# EAGLE schematic powerSupply (EAGLE 9.5.2)
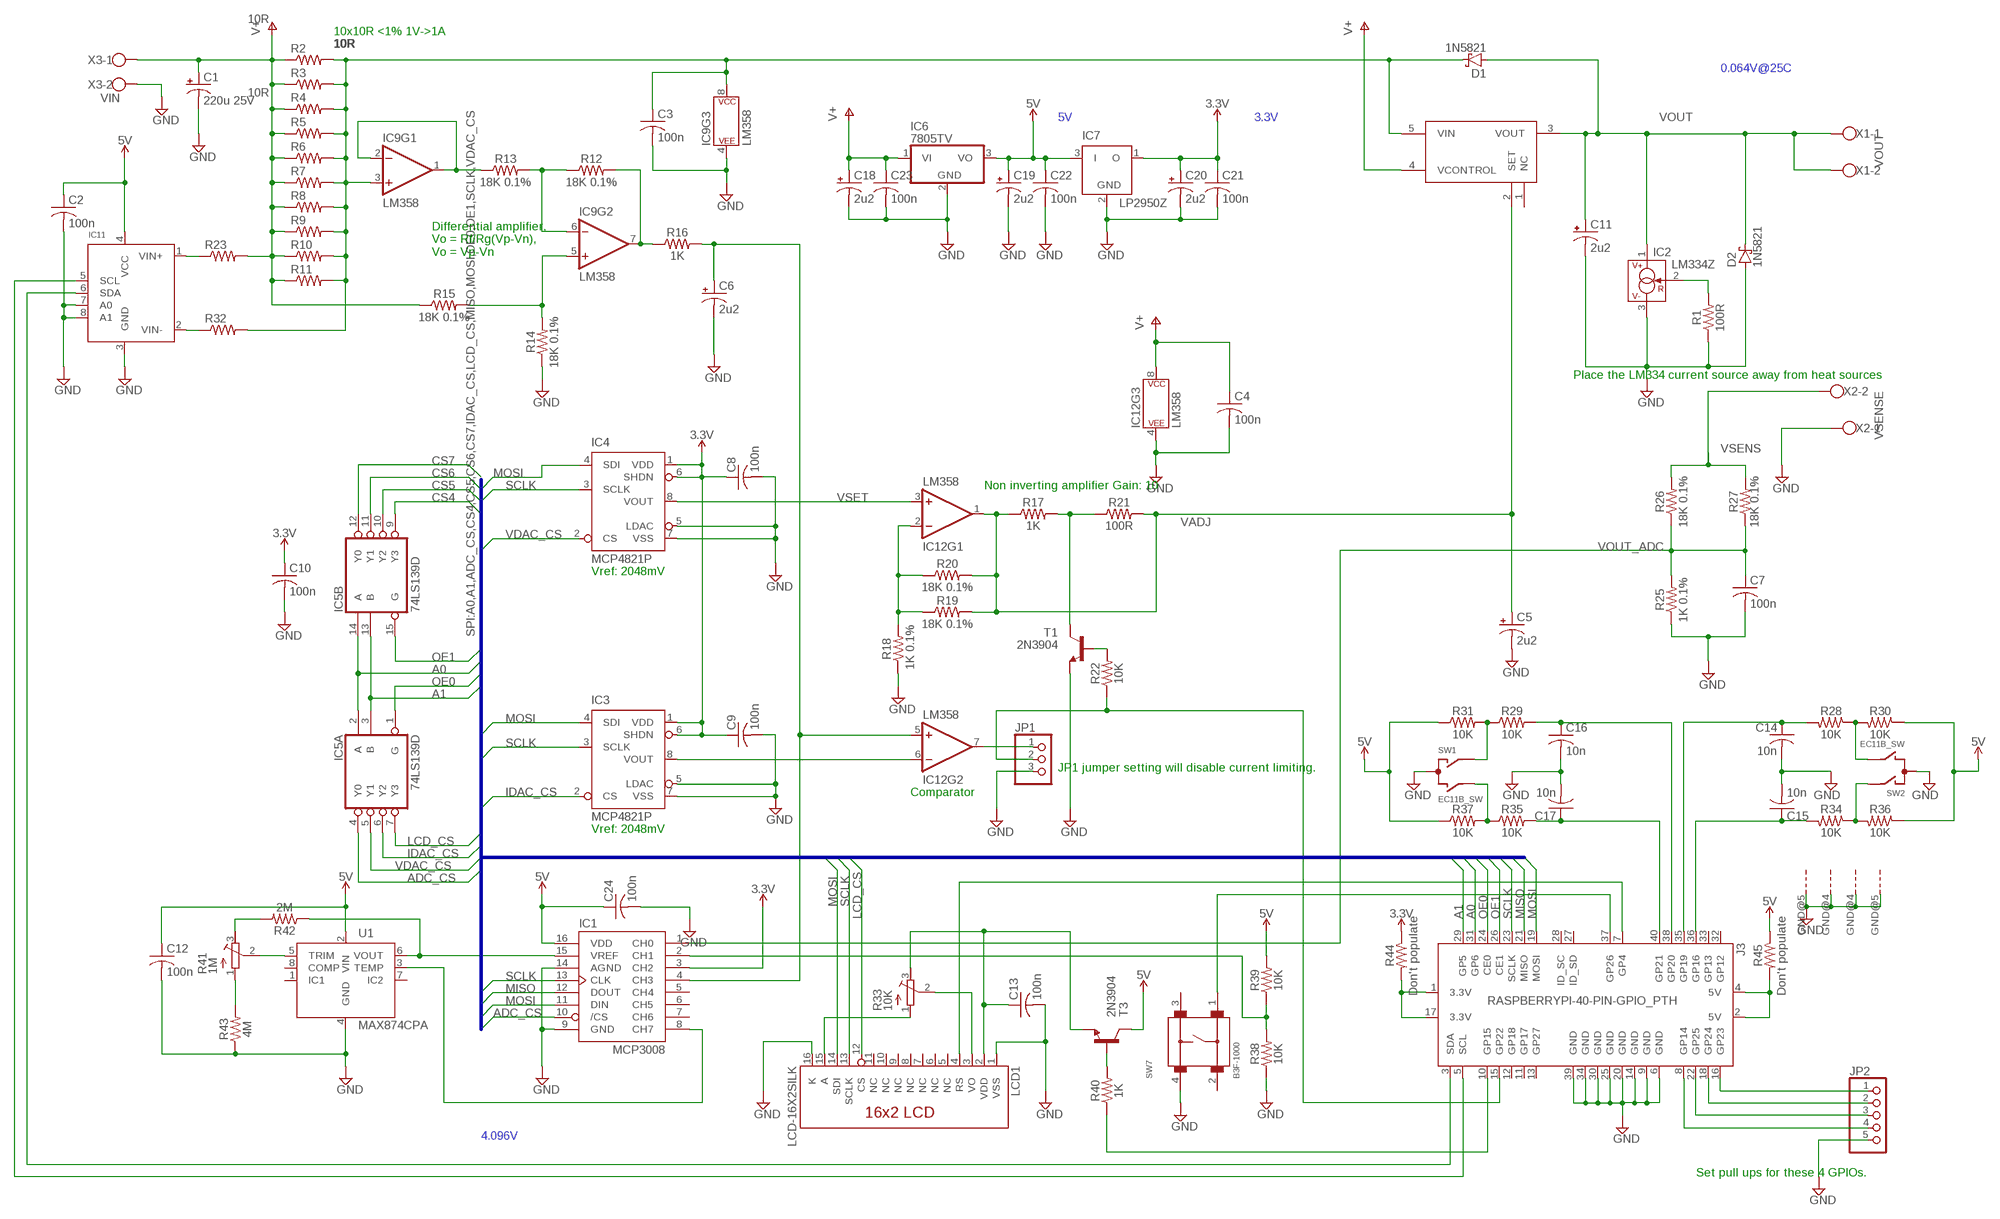
[diagram p0: schematic, sheet 1]

## Parts
C1  220u 25V  CPOL-USE5-6  [E5-6]
C2  100n  C-US050-024X044  [C050-024X044]
C3  100n  C-US050-024X044  [C050-024X044]
C4  100n  C-US050-024X044  [C050-024X044]
C5  2u2  CPOL-USE2-5  [E2-5]
C6  2u2  CPOL-USE2-5  [E2-5]
C7  100n  C-US050-024X044  [C050-024X044]
C8  100n  C-US050-024X044  [C050-024X044]
C9  100n  C-US050-024X044  [C050-024X044]
C10  100n  C-US050-024X044  [C050-024X044]
C11  2u2  CPOL-USE2-5  [E2-5]
C12  100n  C-US050-024X044  [C050-024X044]
C13  100n  C-US050-024X044  [C050-024X044]
C14  10n  C-US050-024X044  [C050-024X044]
C15  10n  C-US050-024X044  [C050-024X044]
C16  10n  C-US050-024X044  [C050-024X044]
C17  10n  C-US050-024X044  [C050-024X044]
C18  2u2  CPOL-USE2-5  [E2-5]
C19  2u2  CPOL-USE2-5  [E2-5]
C20  2u2  CPOL-USE2-5  [E2-5]
C21  100n  C-US050-024X044  [C050-024X044]
C22  100n  C-US050-024X044  [C050-024X044]
C23  100n  C-US050-024X044  [C050-024X044]
C24  100n  C-US050-024X044  [C050-024X044]
D1  1N5821  SCHOTTKY-DIODEC4111-15  [C4111-15]
D2  1N5821  SCHOTTKY-DIODEC4111-15  [C4111-15]
IC1  MCP3008  [DIL16]
IC2  LM334Z  [TO92]
IC3  MCP4821P  [DIP08]
IC4  MCP4821P  [DIP08]
IC5  74LS139D  [SO16]
IC6  7805TV  [TO220V]
IC7  LP2950Z  [TO92]
IC8  LT3080T  [TO220-5]
IC9  LM358  [DIP08]
IC11  INA219  [SOT23-8]
IC12  LM358  [DIP08]
J3  RASPBERRYPI-40-PIN-GPIO_PTH  [2X20_SHROUDED]
JP1  PINHD-1X3  [1X03]
JP2  PINHD-1X5  [1X05]
LCD1  LCD-16X2SILK  [LCD-16X2]
R1  100R  R-US_0204/7  [0204/7]
R2  10R  R-US_0207/12  [0207/12]
R3  10R  R-US_0207/12  [0207/12]
R4  10R  R-US_0207/12  [0207/12]
R5  10R  R-US_0207/12  [0207/12]
R6  10R  R-US_0207/12  [0207/12]
R7  10R  R-US_0207/12  [0207/12]
R8  10R  R-US_0207/12  [0207/12]
R9  10R  R-US_0207/12  [0207/12]
R10  10R  R-US_0207/12  [0207/12]
R11  10R  R-US_0207/12  [0207/12]
R12  18K 0.1%  R-US_0204/7  [0204/7]
R13  18K 0.1%  R-US_0204/7  [0204/7]
R14  18K 0.1%  R-US_0204/7  [0204/7]
R15  18K 0.1%  R-US_0204/7  [0204/7]
R16  1K  R-US_0204/7  [0204/7]
R17  1K  R-US_0204/7  [0204/7]
R18  1K 0.1%  R-US_0204/7  [0204/7]
R19  18K 0.1%  R-US_0204/7  [0204/7]
R20  18K 0.1%  R-US_0204/7  [0204/7]
R21  100R  R-US_0204/7  [0204/7]
R22  10K  R-US_0204/7  [0204/7]
R23  10R  R-US_0207/12  [0207/12]
R25  1K 0.1%  R-US_0204/7  [0204/7]
R26  18K 0.1%  R-US_0204/7  [0204/7]
R27  18K 0.1%  R-US_0204/7  [0204/7]
R28  10K  R-US_0204/7  [0204/7]
R29  10K  R-US_0204/7  [0204/7]
R30  10K  R-US_0204/7  [0204/7]
R31  10K  R-US_0204/7  [0204/7]
R32  10R  R-US_0207/12  [0207/12]
R33  10K  R-TRIMM64W  [RTRIM64W]
R34  10K  R-US_0204/7  [0204/7]
R35  10K  R-US_0204/7  [0204/7]
R36  10K  R-US_0204/7  [0204/7]
R37  10K  R-US_0204/7  [0204/7]
R38  10K  R-US_0204/7  [0204/7]
R39  10K  R-US_0204/7  [0204/7]
R40  1K  R-US_0204/7  [0204/7]
R41  1M  R-TRIMM64W  [RTRIM64W]
R42  2M  R-US_0204/7  [0204/7]
R43  4M  R-US_0204/7  [0204/7]
R44  Don't populate  R-US_0204/7  [0204/7]
R45  Don't populate  R-US_0204/7  [0204/7]
SW1  EC11B_SW  [APLS_EC11B_SW]
SW2  EC11B_SW  [APLS_EC11B_SW]
SW7  B3F-1000  [B3F-1000]
T1  2N3904  [TO92]
T3  2N3904  [TO92]
U1  MAX874CPA  [DIP08]
X1  VOUT  W237-102  [W237-102]
X2  VSENSE  W237-102  [W237-102]
X3  VIN  W237-102  [W237-102]

## Nets
0.064V@25C: IC2.2(R) R1.2
3.3V: C8.1 C9.1 C10.1 C20.+ C21.1 IC1.3(CH2) IC3.1(VDD) IC3.6(SHDN) IC4.1(VDD) IC4.6(SHDN) IC7.1(O) R44.1
4.096V: IC1.15(VREF) R42.1 U1.6(VOUT)
5V: C2.1 C12.1 C19.+ C22.1 C24.1 IC1.16(VDD) IC6.3(VO) IC7.3(I) IC11.4(VCC) R30.1 R31.1 R36.1 R37.1 R39.2 R45.1 T3.1(C) U1.2(VIN)
A0: IC5.2(A:A) IC5.14(B:A) J3.31(GP6)
A1: IC5.3(A:B) IC5.13(B:B) J3.29(GP5)
ADC_CS: IC1.10(/CS) IC5.4(A:Y0)
ADC_IOUT: C6.+ IC1.4(CH3) IC12.5(+IN) R16.2
CS4: IC5.9(B:Y3)
CS5: IC5.10(B:Y2)
CS6: IC5.11(B:Y1)
CS7: IC5.12(B:Y0)
GND: C1.- C2.2 C3.2 C4.2 C5.- C6.- C7.2 C8.2 C9.2 C10.2 C11.- C12.2 C13.2 C14.2 C15.2 C16.2 C17.2 C18.- C19.- C20.- C21.2 C22.2 C23.2 C24.2 D2.A IC1.9(GND) IC1.14(AGND) IC2.3(V-) IC3.5(LDAC) IC3.7(VSS) IC4.5(LDAC) IC4.7(VSS) IC6.2(GND) IC7.2(GND) IC9.4(P$V-) IC11.3(GND) IC11.7(A0) IC11.8(A1) IC12.4(P$V-) J3.6(GND) J3.9(GND) J3.14(GND) J3.20(GND) J3.25(GND) J3.30(GND) J3.34(GND) J3.39(GND) JP1.3 JP2.5 LCD1.1(VSS) LCD1.16(K) R1.1 R14.1 R18.1 R25.1 R38.1 R43.1 SW1.GND@4(G) SW1.GND@5(G) SW1.P$3(C) SW2.GND@4(G) SW2.GND@5(G) SW2.P$3(C) SW7.4 T1.3(E) U1.4(GND) X2.1 X3.2
IDAC_CS: IC3.2(CS) IC5.6(A:Y2)
LCD_CS: IC5.7(A:Y3) LCD1.12(CS)
MISO: IC1.12(DOUT) J3.21(MISO)
MOSI: IC1.11(DIN) IC3.4(SDI) IC4.4(SDI) J3.19(MOSI) LCD1.14(SDI)
N$1: IC3.8(VOUT) IC12.6(-IN)
N$2: IC1.2(CH1) R38.2 R39.1
N$3: LCD1.3(VO) R33.2(S)
N$4: IC11.1(VIN+) R23.1
N$5: IC1.8(CH7) U1.3(TEMP)
N$6: IC9.1(OUT) IC9.2(-IN) R13.1
N$7: IC9.6(-IN) R12.1 R13.2
N$8: R17.2 R21.1 T1.1(C)
N$9: IC9.5(+IN) R14.2 R15.2
N$10: C4.1 IC12.8(P$V+) ; supply symbol labelled V+
N$11: IC9.7(OUT) R12.2 R16.1
N$12: R22.2 T1.2(B)
N$13: IC12.2(-IN) R18.2 R19.1 R20.1
N$14: IC12.7(OUT) JP1.1
N$18: LCD1.15(A) R33.1(A)
N$19: IC11.2(VIN-) R32.1
N$20: J3.15(GP22) JP1.2 R22.1
N$21: J3.7(GP4) LCD1.4(RS)
N$22: R28.1 R30.2 SW2.P$2(B)
N$23: C14.1 J3.35(GP19) R28.2
N$24: C15.1 J3.36(GP16) R34.2
N$25: R34.1 R36.2 SW2.P$1(A)
N$26: C16.1 J3.38(GP20) R29.2
N$27: C17.1 J3.40(GP21) R35.2
N$28: R29.1 R31.2 SW1.P$1(A)
N$29: R35.1 R37.2 SW1.P$2(B)
N$30: J3.16(GP23) JP2.1
N$31: J3.18(GP24) JP2.2
N$32: J3.22(GP25) JP2.3
N$33: J3.8(GP14) JP2.4
N$34: IC11.6(SDA) J3.3(SDA)
N$35: IC11.5(SCL) J3.5(SCL)
N$36: J3.37(GP26) SW7.1
N$37: R40.2 T3.2(B)
N$38: C13.1 LCD1.2(VDD) R33.3(E) T3.3(E)
N$39: J3.10(GP15) R40.1
N$40: R41.2(S) U1.5(TRIM)
N$41: R41.3(E) R42.2
N$42: J3.1(3.3V) J3.17(3.3V) R44.2
N$43: R41.1(A) R43.2
N$44: J3.2(5V) J3.4(5V) R45.2
OE0: IC5.1(A:G) J3.24(CE0)
OE1: IC5.15(B:G) J3.26(CE1)
SCLK: IC1.13(CLK) IC3.3(SCLK) IC4.3(SCLK) J3.23(SCLK) LCD1.13(SCLK)
V+: C1.+ C18.+ C23.1 IC6.1(VI) IC8.4(VCONTROL) R2.1 R3.1 R4.1 R5.1 R6.1 R7.1 R8.1 R9.1 R10.1 R11.1 R15.1 R23.2 X3.1
VADJ: C5.+ IC8.2(SET) IC12.1(OUT) R17.1 R19.2 R20.2 R21.2
VDAC_CS: IC4.2(CS) IC5.5(A:Y1)
VOUT: C11.+ D1.A D2.C IC2.1(V+) IC8.3(VOUT) X1.1 X1.2
VOUT_ADC: C7.1 IC1.1(CH0) R25.2 R26.1 R27.1
VR: C3.1 D1.C IC8.5(VIN) IC9.3(+IN) IC9.8(P$V+) R2.2 R3.2 R4.2 R5.2 R6.2 R7.2 R8.2 R9.2 R10.2 R11.2 R32.2
VSENS: R26.2 R27.2 X2.2
VSET: IC4.8(VOUT) IC12.3(+IN)
Unconnected: IC1.5(CH4) IC1.6(CH5) IC1.7(CH6) IC8.1(NC) J3.11(GP17) J3.12(GP18) J3.13(GP27) J3.27(ID_SD) J3.28(ID_SC) J3.32(GP12) J3.33(GP13) LCD1.5(NC) LCD1.6(NC) LCD1.7(NC) LCD1.8(NC) LCD1.9(NC) LCD1.10(NC) LCD1.11(NC) SW7.2 SW7.3 U1.1(IC1) U1.7(IC2) U1.8(COMP)

## Buses
SPI:A0,A1,ADC_CS,CS4,CS5,CS6,CS7,IDAC_CS,LCD_CS,MISO,MOSI,OE0,OE1,SCLK,VDAC_CS

## Notes on the sheet
- 10x10R <1% 1V->1A
- Differential amplifier, 
  Vo = Rf/Rg(Vp-Vn), 
  Vo = Vp-Vn
- Place the LM334 current source away from heat sources
- Non inverting amplifier Gain: 10
- Vref: 2048mV
- JP1 jumper setting will disable current limiting.
- Comparator
- Vref: 2048mV
- Set pull ups for these 4 GPIOs.

## Power pins joined to a net without a drawn wire
GND: IC5.8(P:GND)
VCC: IC5.16(P:VCC)

## Library data of the parts
C1 = rcl:CPOL-US: POLARIZED CAPACITOR, American symbol; SPICEPREFIX: C
C2-C4 C7-C10 C12-C17 C21-C24 = adafruit:C-US: CAPACITOR, American symbol
C5 C6 C11 C18-C20 = adafruit:CPOL-US: POLARIZED CAPACITOR, American symbol
D1 D2 = diode:SCHOTTKY-DIODE: Schottky Diode
IC1 = adafruit:MCP3008
IC2 = linear:LM*34: 3-Terminal Adjustable Current Sources Source: www.national.com/pf/LM/LM334.html | LM134.pdf
IC3 IC4 = mixedSignal:MCP4821P: 12-Bit Voltage Output Digital-to-Analog Converter with Internal VREF and SPI Interface
IC5 = 74xx-us:74*139: Dual 2-line to 4-line DECODER/DEMULTIPLEXER
IC6 = linear:78*: Positive VOLTAGE REGULATOR Source: http://cache.national.com/ds/LM/LM78L05.pdf http://www.fairchildsemi.com/ds/LM/LM7805.pdf
IC7 = linear:LP2950: 100 mA, Low Power Low Dropout Voltage Regulator Source: http://www.onsemi.com/pub/Collateral/LP2950-D.PDF
IC8 = LinearRegulators:LT3080T: Adjustable 3A Single Resistor Low Dropout Regulator
IC9 IC12 = SparkFun-IC-Amplifiers:LM358: LM358 Jellybean op-amp Datasheet <http://www.sparkfun.com/datasheets/Components/General/LM358.pdf> SparkFun Products Op-Amp (Thru-Hole) - LM358 <https://www.sparkfun.com/products/9456> (COM-09456); PROD_ID: IC-09172
IC11 = Hexellence-mixedSignal:INA219: INA219 - I2C Current/Power Monitor Voltage Range: 0-26V Accuracy: 0.5% Temperature: -40°C - 125°C
J3 = Hexellence-Connectors:RASPBERRYPI-40-PIN-GPIO: Raspberry Pi GPIO Header 2x20 pin connector, as found on B, B+, A+ models. Both shrouded PTH and SMT versions available. SparkFun Products: GPIO Shrouded Header <https://www.sparkfun.com/products/13054>- PTH SparkFun Pi Wedge (Preassembled) <https://www.sparkfun.com/products/13717>; PROD_ID: CONN-12263; SF_ID: PRT-13054
JP1 = adafruit:PINHD-1X3: PIN HEADER
JP2 = pinhead:PINHD-1X5: PIN HEADER
LCD1 = Hexellence-Displays:LCD-16X2: Standard text-only 16x2 parallel input LCD Basic 16 character by 2 line display. Typically utilizes the extremely common HD44780 parallel interface chipset SparkFun Products: Basic 16x2 Green <https://www.sparkfun.com/products/255> Basic 8x2 Green <https://www.sparkfun.com/products/11122>; PROD_ID: LCD-12633; SF_ID: LCD-00255
R1 R12-R22 R25-R31 R34-R40 R42-R45 = rcl:R-US_: RESISTOR, American symbol; SPICEPREFIX: R
R2-R11 R23 R32 = adafruit:R-US_: RESISTOR, American symbol
R33 R41 = resistor:R-TRIMM: Trimm resistor
SW1 SW2 = Hexellence-Switch:EC11B_SW
SW7 = Switch:B3F-1000: Tactile Switch SPST-NO Top Actuated Through Hole Manufacturer's datasheet <https://omronfs.omron.com/en_US/ecb/products/pdf/en-b3f.pdf>; CREATED_BY: PCBLayout.com; DIGI_KEY_PART_NUMBER: SW400-ND; MANUFACTURER: Omron Electronics Inc-EMC Div; MPN: B3F-1000; PACKAGE: SPST-NO
T1 T3 = transistor:2N3904: NPN TRANSISTOR
U1 = Hexellence-mixedSignal:MAX874CPA
X1-X3 = con-wago-500:W237-102: WAGO SCREW CLAMP; MPN: 237-102; OC_FARNELL: unknown; OC_NEWARK: 70K9898